# Altium schematic sheet Memory-Buffer.SchDoc
size B; SheetNumber: 7; SheetTotal: 9
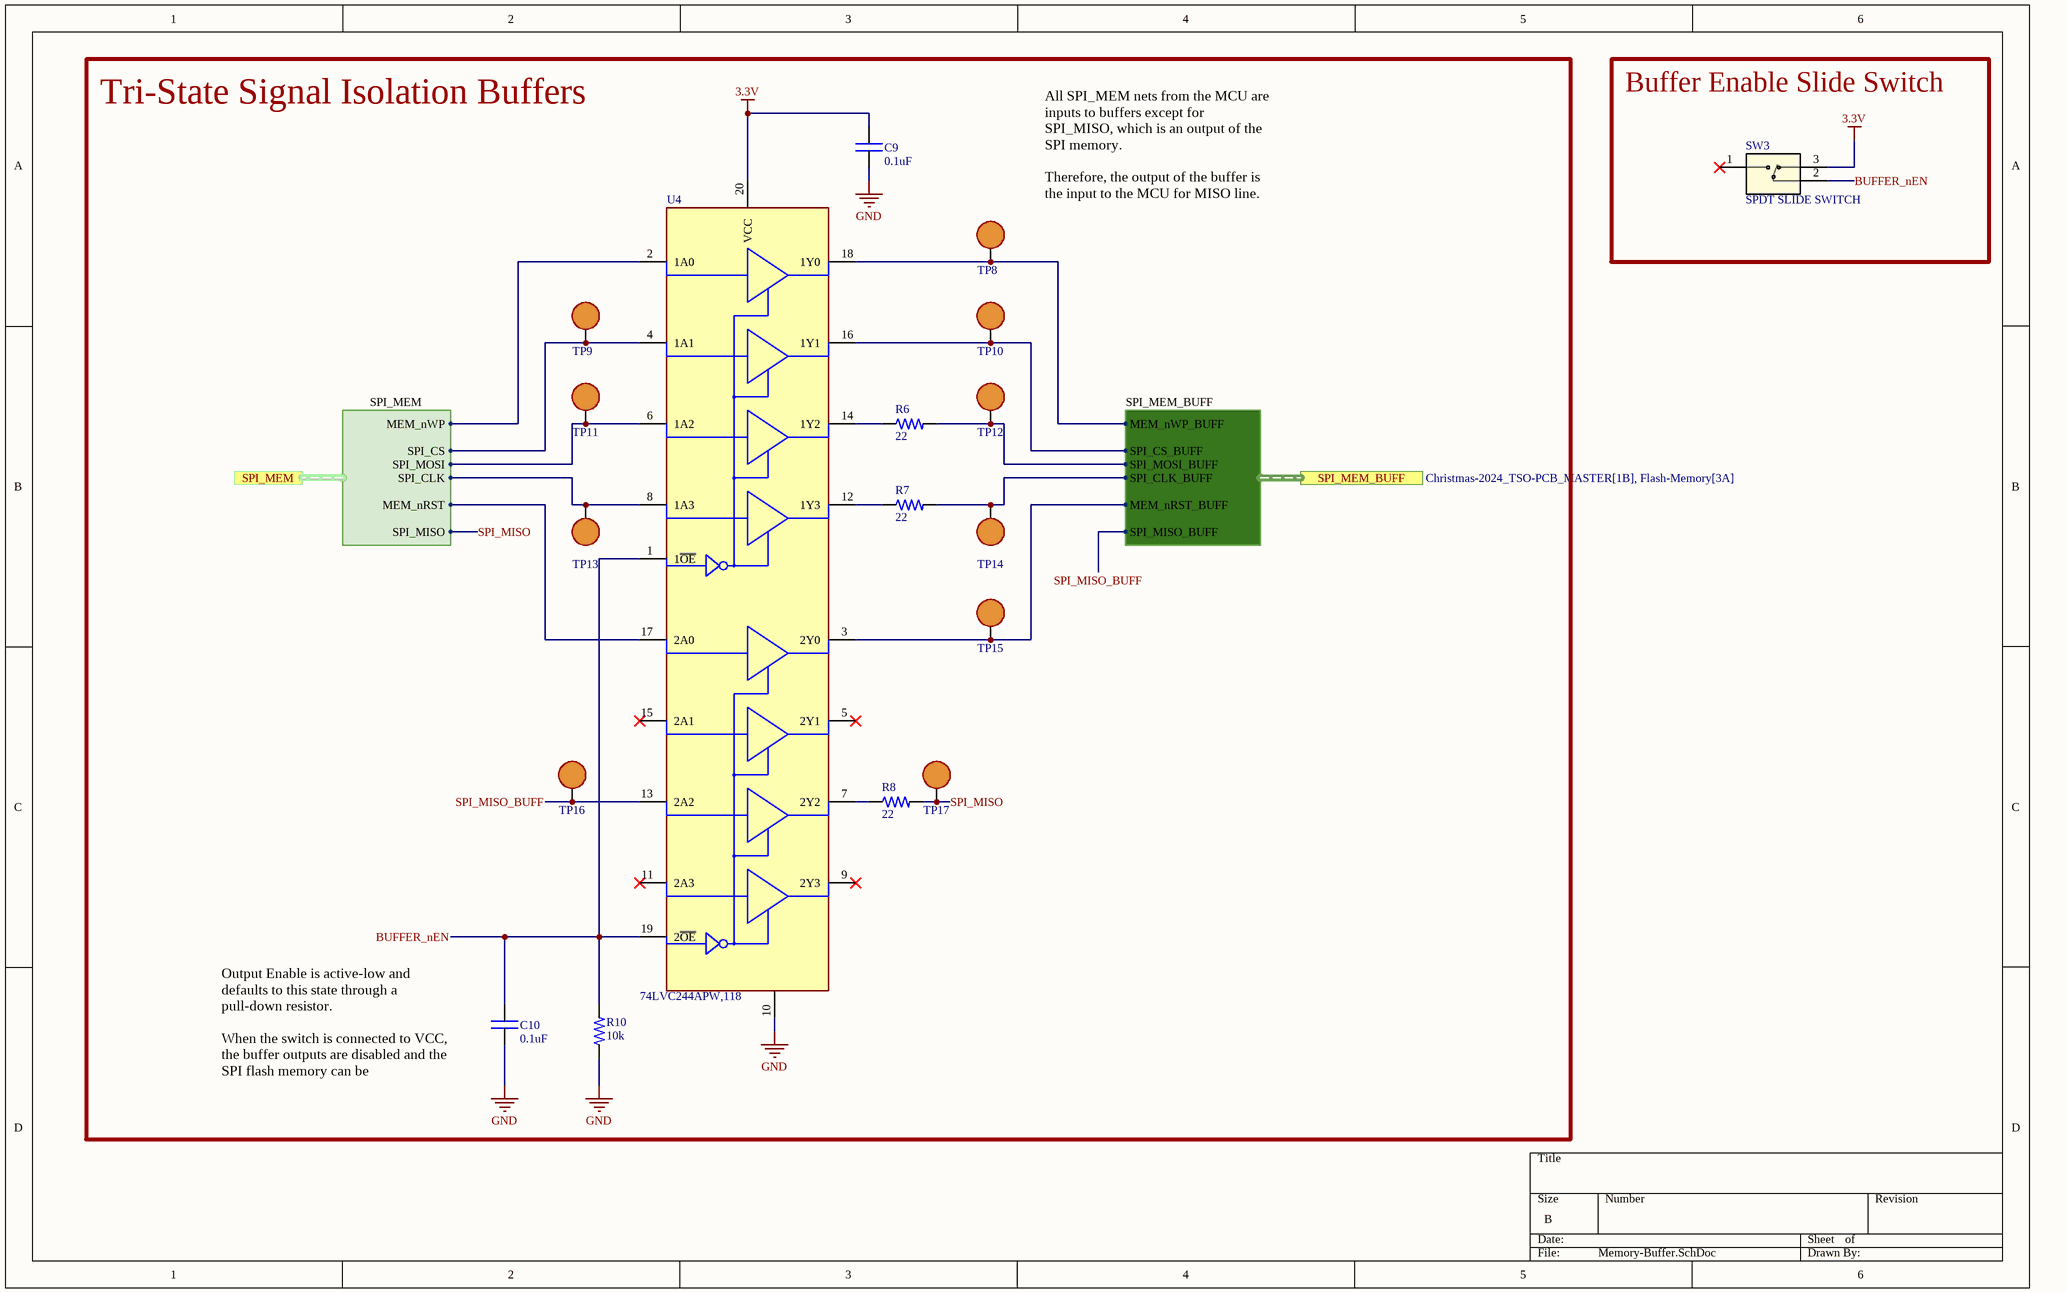
[diagram p0: Memory-Buffer.SchDoc]

## Parts
C9  value 0.1uF  [0402C]  (hidden comment: CAP)
C10  value 0.1uF  [0402C]  (hidden comment: CAP)
R6  value 22  [0402R]  (hidden comment: RES)
R7  value 22  [0402R]  (hidden comment: RES)
R8  value 22  [0402R]  (hidden comment: RES)
R10  value 10k  [0402R]  (hidden comment: RES)
SW3  SPDT SLIDE SWITCH  [CJS-1200TB]
TP8  RCWCTE  [TP - SMALL]  (value not drawn)
TP9  RCWCTE  [TP - SMALL]  (value not drawn)
TP10  RCWCTE  [TP - SMALL]  (value not drawn)
TP11  RCWCTE  [TP - SMALL]  (value not drawn)
TP12  RCWCTE  [TP - SMALL]  (value not drawn)
TP13  RCWCTE  [TP - SMALL]  (value not drawn)
TP14  RCWCTE  [TP - SMALL]  (value not drawn)
TP15  RCWCTE  [TP - SMALL]  (value not drawn)
TP16  RCWCTE  [TP - SMALL]  (value not drawn)
TP17  RCWCTE  [TP - SMALL]  (value not drawn)
U4  74LVC244APW,118  [20-TSSOP]

## Blocks framed on the sheet
Tri-State Signal Isolation Buffers: C9 C10 R6-R8 R10 TP8-TP17 U4
Buffer Enable Slide Switch: SW3

## Ports
SPI_MEM (harness SPI_MEM, see Christmas-2024_TSO-PCB_MASTER[2B], MCU[1B]), SPI_MEM_BUFF (harness SPI_MEM_BUFF, see Christmas-2024_TSO-PCB_MASTER[1B], Flash-Memory[3A])

## Harnesses
SPI_MEM: SPI_CLK, SPI_MISO, SPI_MOSI, SPI_CS, MEM_nWP, MEM_nRST
SPI_MEM_BUFF: SPI_CLK_BUFF, SPI_MISO_BUFF, SPI_MOSI_BUFF, SPI_CS_BUFF, MEM_nWP_BUFF, MEM_nRST_BUFF

## Nets
3.3V: C9.2 SW3.3 U4.20(VCC)
GND: C9.1 C10.1 R10.1 U4.10(GND)
BUFFER_nEN: C10.2 R10.2 SW3.2 U4.1(1~{OE}) U4.19(2~{OE})
SPI_MISO: R8.2 TP17.1 ; port SPI_MEM.SPI_MISO
SPI_MISO_BUFF: TP16.1 U4.13(2A2) ; port SPI_MEM_BUFF.SPI_MISO_BUFF
NetR6_1: R6.1 U4.14(1Y2)
NetR6_2: R6.2 TP12.1 ; port SPI_MEM_BUFF.SPI_MOSI_BUFF
NetR7_1: R7.1 U4.12(1Y3)
NetR7_2: R7.2 TP14.1 ; port SPI_MEM_BUFF.SPI_CLK_BUFF
NetR8_1: R8.1 U4.7(2Y2)
NetTP8_1: TP8.1 U4.18(1Y0) ; port SPI_MEM_BUFF.MEM_nWP_BUFF
NetTP9_1: TP9.1 U4.4(1A1) ; port SPI_MEM.SPI_CS
NetTP10_1: TP10.1 U4.16(1Y1) ; port SPI_MEM_BUFF.SPI_CS_BUFF
NetTP11_1: TP11.1 U4.6(1A2) ; port SPI_MEM.SPI_MOSI
NetTP13_1: TP13.1 U4.8(1A3) ; port SPI_MEM.SPI_CLK
NetTP15_1: TP15.1 U4.3(2Y0) ; port SPI_MEM_BUFF.MEM_nRST_BUFF
NetU4_2: U4.2(1A0) ; port SPI_MEM.MEM_nWP
NetU4_17: U4.17(2A0) ; port SPI_MEM.MEM_nRST

Not connected (* = marked no-connect by the designer): SW3 1*; U4 5(2Y1)* 9(2Y3)* 11(2A3)* 15(2A1)*

## Notes on the sheet
- All SPI_MEM nets from the MCU are inputs to buffers except for SPI_MISO, which is an output of the SPI memory.
  Therefore, the output of the buffer is the input to the MCU for MISO line.
- Output Enable is active-low and defaults to this state through a pull-down resistor.
  When the switch is connected to VCC, the buffer outputs are disabled and the SPI flash memory can be programmed.

## Library data of the parts
C9 C10 = CAP: Capacitor; MFR: Samsung; MFR PN: CL05B104KP5NNNC; Type: SMD
R6-R8 = RES: Resistor; MFR PN: RC0402FR-0722RL; MFR: YAGEO; Type: SMD
R10 = RES: Resistor; MFR PN: RC0402JR-0710KL; MFR: YAGEO; Type: SMD
SW3 = SPDT SLIDE SWITCH: MFR: Nidec Components Corporation; MFR PN: CJS-1200TB; Type: SMD
TP8-TP17 = TEST POINT: Test Point, Surface Mount; MFR PN: DNS; MFR: *; Type: SMD
U4 = TRI-STATE BUFFERS 8 CIRC: NXP 74LVC244APW,115 Octal Buffer & Line Driver, 3-State, 1.2  3.6 V, 20-Pin TSSOP; MFR: Nexperia; MFR PN: 74LVC244APW,118; Type: SMD